# EAGLE design mini (EAGLE 6.2)
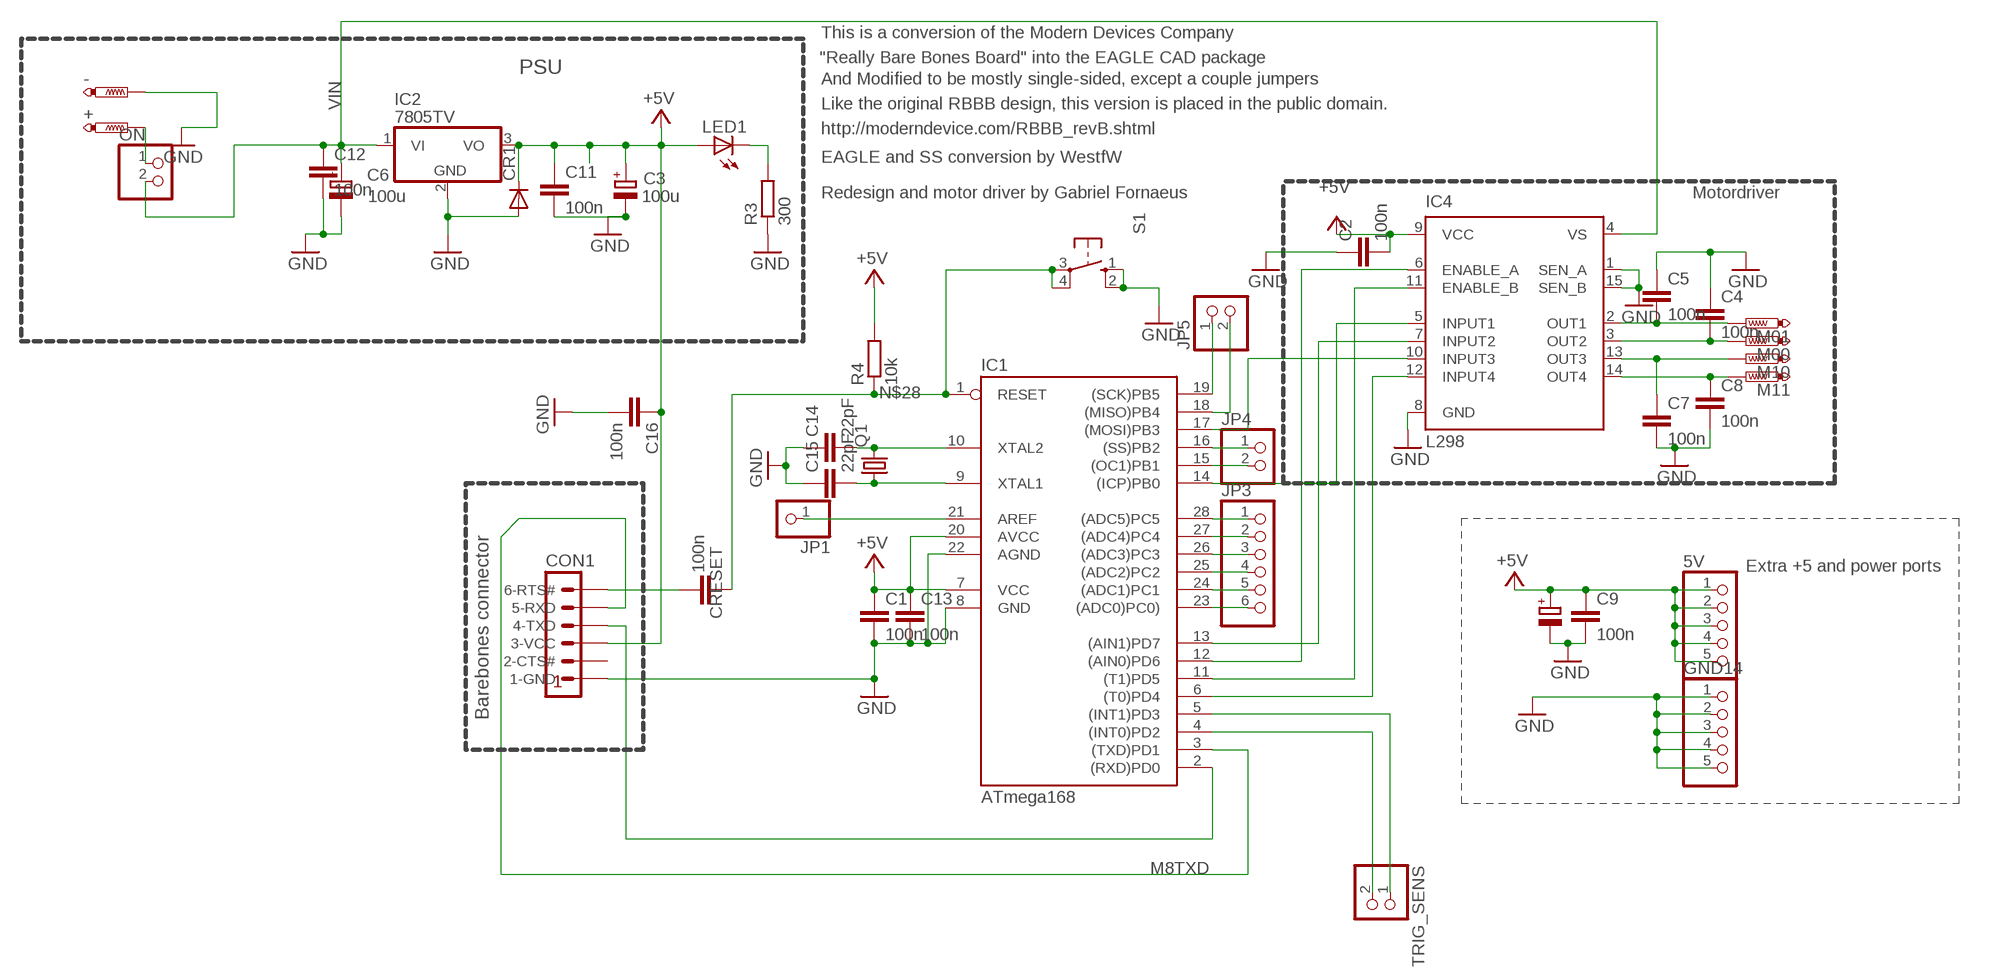
[diagram p0: schematic, sheet 1]

## Parts
5V  PINHD-1X5  [1X05]
+  PTR1PAD1-13Y  [P1-13Y]
-  PTR1PAD1-13Y  [P1-13Y]
C1  100n  C-EU025-025X050  [C025-025X050]
C2  100n  C-EU025-025X050  [C025-025X050]
C3  100u  CPOL-EUE2.5-7  [E2,5-7]
C4  100n  C-EU025-025X050  [C025-025X050]
C5  100n  C-EU025-025X050  [C025-025X050]
C6  100u  CPOL-EUE2.5-7  [E2,5-7]
C7  100n  C-EU025-025X050  [C025-025X050]
C8  100n  C-EU025-025X050  [C025-025X050]
C9  100n  C-EU025-025X050  [C025-025X050]
C10  100u  CPOL-EUE2.5-7  [E2,5-7]
C11  100n  C-EU025-025X050  [C025-025X050]
C12  100n  C-EU025-025X050  [C025-025X050]
C13  100n  C-EU025-025X050  [C025-025X050]
C14  22pF  C-EU025-024X044  [C025-024X044]
C15  22pF  C-EU025-024X044  [C025-024X044]
C16  100n  C-EU025-025X050  [C025-025X050]
CON1  FTDI-TTL232R  [MA06-1]
CR1  DIODE-1ARECT-2V  [DO41-2V]
CRESET  100n  C-EU025-025X050  [C025-025X050]
GND14  PINHD-1X5  [1X05]
IC1  ATmega168  AT90S4433P  [DIL28-3]
IC2  7805TV  [TO220V]
IC4  L298  [MULTIWATT-15]
JP1  PINHD-1X1  [1X01]
JP3  PINHD-1X6  [1X06]
JP4  PINHD-1X2  [1X02]
JP5  PINHD-1X2  [1X02]
LED1  LED3MM  [LED3MM]
M00  PTR1PAD1-13Y  [P1-13Y]
M01  PTR1PAD1-13Y  [P1-13Y]
M10  PTR1PAD1-13Y  [P1-13Y]
M11  PTR1PAD1-13Y  [P1-13Y]
ON  PINHD-1X2  [1X02]
Q1  CRYSTALHC49S  [HC49/S]
R3  300  R-EU_0204/7  [0204/7]
R4  10k  R-EU_0204/7  [0204/7]
S1  10-XX  [B3F-10XX]
TRIG_SENS  PINHD-1X2  [1X02]

## Nets
+5V [power]: 5V.1 5V.2 5V.3 5V.4 5V.5 C1.1 C2.2 C3.+ C9.1 C10.+ C11.1 C13.1 C16.1 CON1.3(3-VCC) CR1.C IC1.7(VCC) IC1.20(AVCC) IC2.3(VO) IC4.9(VCC) LED1.A R4.2
GND [power]: -.TP C1.2 C2.1 C3.- C4.1 C5.1 C6.- C7.2 C8.2 C9.2 C10.- C11.2 C12.2 C13.2 C14.1 C15.1 C16.2 CON1.1(1-GND) CR1.A GND14.1 GND14.2 GND14.3 GND14.4 GND14.5 IC1.8(GND) IC1.22(AGND) IC2.2(GND) IC4.1(SEN_A) IC4.8(GND) IC4.15(SEN_B) R3.1 S1.1(S) S1.2(S1)
M8RXD: CON1.4(4-TXD) IC1.2((RXD)PD0)
M8TXD: CON1.5(5-RXD) IC1.3((TXD)PD1)
N$1: IC1.28((ADC5)PC5) JP3.1
N$2: LED1.K(C) R3.2
N$3: IC1.13((AIN1)PD7) IC4.7(INPUT2)
N$4: IC1.27((ADC4)PC4) JP3.2
N$5: IC1.26((ADC3)PC3) JP3.3
N$6: C15.2 IC1.9(XTAL1) Q1.1
N$7: C14.2 IC1.10(XTAL2) Q1.2
N$8: CON1.6(6-RTS#) CRESET.1
N$9: IC1.11((T1)PD5) IC4.11(ENABLE_B)
N$10: IC1.6((T0)PD4) IC4.12(INPUT4)
N$11: C7.1 IC4.13(OUT3) M10.TP
N$12: IC1.25((ADC2)PC2) JP3.4
N$13: C8.1 IC4.14(OUT4) M11.TP
N$14: IC1.14((ICP)PB0) IC4.5(INPUT1)
N$15: C4.2 IC4.3(OUT2) M00.TP
N$16: IC1.24((ADC1)PC1) JP3.5
N$17: IC1.23((ADC0)PC0)) JP3.6
N$18: C5.2 IC4.2(OUT1) M01.TP
N$19: IC1.17((MOSI)PB3) IC4.10(INPUT3)
N$20: IC1.12((AIN0)PD6) IC4.6(ENABLE_A)
N$21: +.TP ON.1
N$22: IC1.16((SS)PB2) JP4.1
N$23: IC1.15((OC1)PB1) JP4.2
N$24: IC1.18((MISO)PB4) JP5.2
N$25: IC1.19((SCK)PB5) JP5.1
N$28: CRESET.2 IC1.1(RESET) R4.1 S1.3(P) S1.4(P1)
N$29: IC1.21(AREF) JP1.1
N$30: IC1.5((INT1)PD3) TRIG_SENS.1
N$31: IC1.4((INT0)PD2) TRIG_SENS.2
VIN [power]: C6.+ C12.1 IC2.1(VI) IC4.4(VS) ON.2
Unconnected: CON1.2(2-CTS#)

## Notes on the sheet
- This is a conversion of the Modern Devices Company
- "Really Bare Bones Board" into the EAGLE CAD package
- PSU
- And Modified to be mostly single-sided, except a couple jumpers
- Like the original RBBB design, this version is placed in the public domain.
- http://moderndevice.com/RBBB_revB.shtml
- EAGLE and SS conversion by WestfW
- Redesign and motor driver by Gabriel Fornaeus | Motordriver
- Extra +5 and power ports
- Barebones connector

## Library data of the parts
5V GND14 = pinhead:PINHD-1X5: PIN HEADER
+ - M00 M01 M10 M11 = testpad:PTR1: TEST PIN
C1 C2 C4 C5 C7-C9 C11-C13 C16 CRESET = my-rcl:C-EU: CAPACITOR, European symbol
C3 C6 C10 = my-rcl:CPOL-EU: POLARIZED CAPACITOR, European symbol
C14 C15 = resistor:C-EU: CAPACITOR, European symbol
CON1 = mylib4:FTDI-TTL232R: FTDI USB to serial (TTL level) cable
CR1 = mylib4:DIODE-1ARECT
IC1 = atmel:AT90S4433: MICROCONTROLLER 4 Kbytes FLASH 128 bytes SRAM 256 bytes EEPROM UART 6-channel 10 bit ADC
IC2 = linear:78*: Positive VOLTAGE REGULATOR Source: http://cache.national.com/ds/LM/LM78L05.pdf http://www.fairchildsemi.com/ds/LM/LM7805.pdf
IC4 = st-microelectronics:L298: DUAL FULL-BRIDGE DRIVER; MPN: L298N; OC_FARNELL: 1589425; OC_NEWARK: 32M1527
JP1 = pinhead:PINHD-1X1: PIN HEADER
JP3 = pinhead:PINHD-1X6: PIN HEADER
JP4 JP5 ON TRIG_SENS = pinhead:PINHD-1X2: PIN HEADER
LED1 = led:LED: LED OSRAM: - CHIPLED LG R971, LG N971, LY N971, LG Q971, LY Q971, LO R971, LY R971 LH N974, LH R974 LS Q976, LO Q976, LY Q976 LO Q996 - Hyper CHIPLED LW Q18S LB Q993, LB Q99A, LB R99A - SideLED LS A670, LO A670, LY A670, LG A670, LP A670 LB A673, LV A673, LT A673, LW A673 LH A674 LY A675 LS A676, LA A676, LO A676, LY A676, LW A676 LS A679, LY A679, LG A679 - Hyper Micro SIDELED® LS Y876, LA Y876, LO Y876, LY Y876 LT Y87S - SmartLED LW L88C, LW L88S LB L89C, LB L89S, LG L890 LS L89K, LO L89K, LY L89K LS L896, LA L896, LO L896, LY L896 - TOPLED LS T670, LO T670, LY T670, LG T670, LP T670 LSG T670, LSP T670, LSY T670, LOP T670, LYG T670 LG T671, LOG T671, LSG T671 LB T673, LV T673, LT T673, LW T673 LH T674 LS T676, LA T676, LO T676, LY T676, LB T676, LH T676, LSB T676, LW T676 LB T67C, LV T67C, LT T67C, LS T67K, LO T67K, LY T67K, LW E67C LS E67B, LA E67B, LO E67B, LY E67B, LB E67C, LV E67C, LT E67C LW T67C LS T679, LY T679, LG T679 LS T770, LO T770, LY T770, LG T770, LP T770 LB T773, LV T773, LT T773, LW T773 LH T774 LS E675, LA E675, LY E675, LS T675 LS T776, LA T776, LO T776, LY T776, LB T776 LHGB T686 LT T68C, LB T68C - Hyper Mini TOPLED® LB M676 - Mini TOPLED Santana® LG M470 LS M47K, LO M47K, LY M47K Source: http://www.osram.convergy.de - LUMILED® LXK2-PW12-R00, LXK2-PW12-S00, LXK2-PW14-U00, LXK2-PW14-V00 LXK2-PM12-R00, LXK2-PM12-S00, LXK2-PM14-U00 LXK2-PE12-Q00, LXK2-PE12-R00, LXK2-PE12-S00, LXK2-PE14-T00, LXK2-PE14-U00 LXK2-PB12-K00, LXK2-PB12-L00, LXK2-PB12-M00, LXK2-PB14-N00, LXK2-PB14-P00, LXK2-PB14-Q00 LXK2-PR12-L00, LXK2-PR12-M00, LXK2-PR14-Q00, LXK2-PR14-R00 LXK2-PD12-Q00, LXK2-PD12-R00, LXK2-PD12-S00 LXK2-PH12-R00, LXK2-PH12-S00 LXK2-PL12-P00, LXK2-PL12-Q00, LXK2-PL12-R00 Source: www.luxeon.com
Q1 = crystal:CRYSTAL: CRYSTAL; OC_FARNELL: 1667008; OC_NEWARK: unknown
R3 R4 = resistor:R-EU_: RESISTOR, European symbol
S1 = switch-omron:10-XX: OMRON SWITCH

## Net classes
0 default: width 0.4 mm, clearance 0.3 mm
1 power: width 0.6 mm, clearance 0.3 mm

## Board
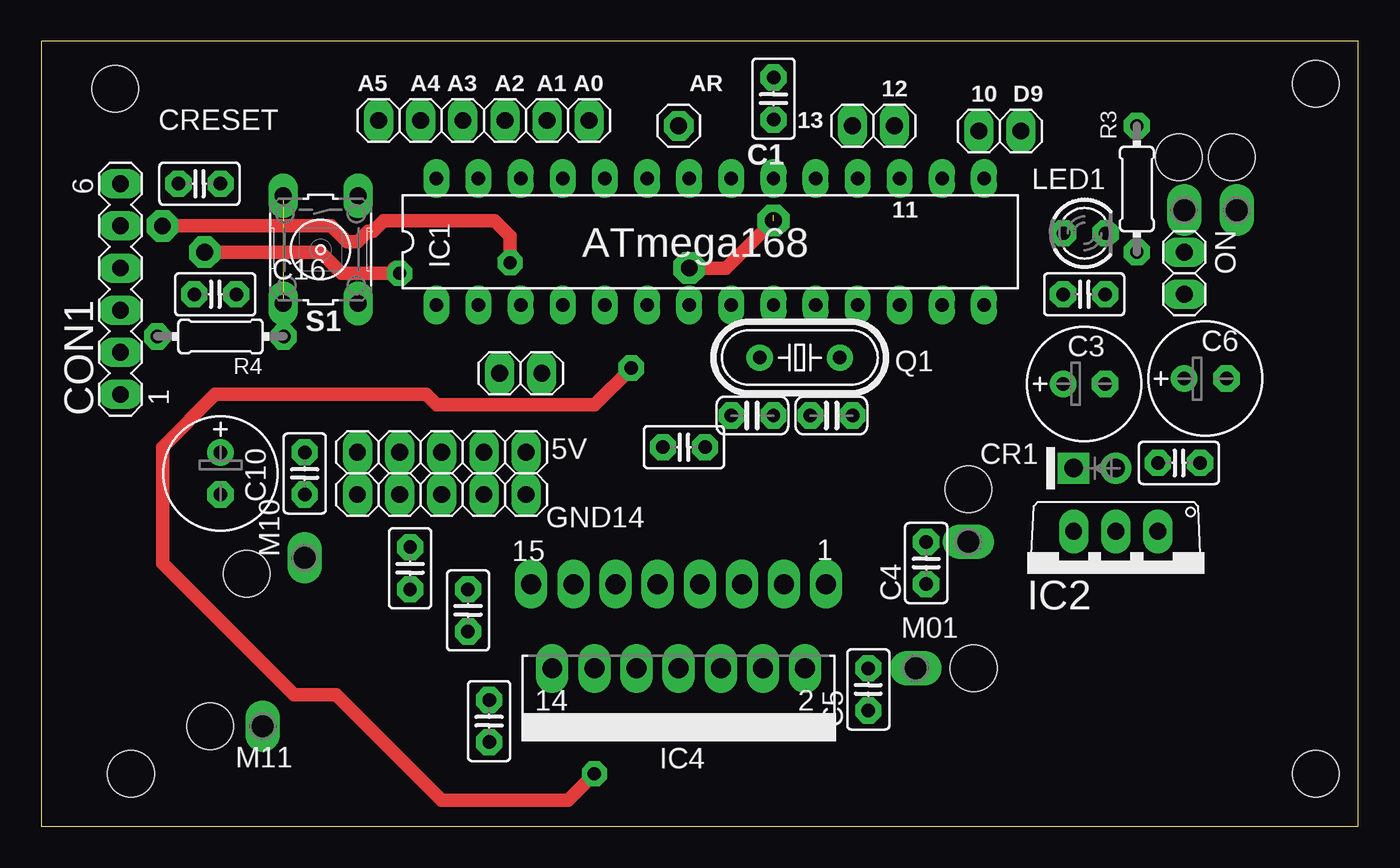
[diagram p1: board, top side]
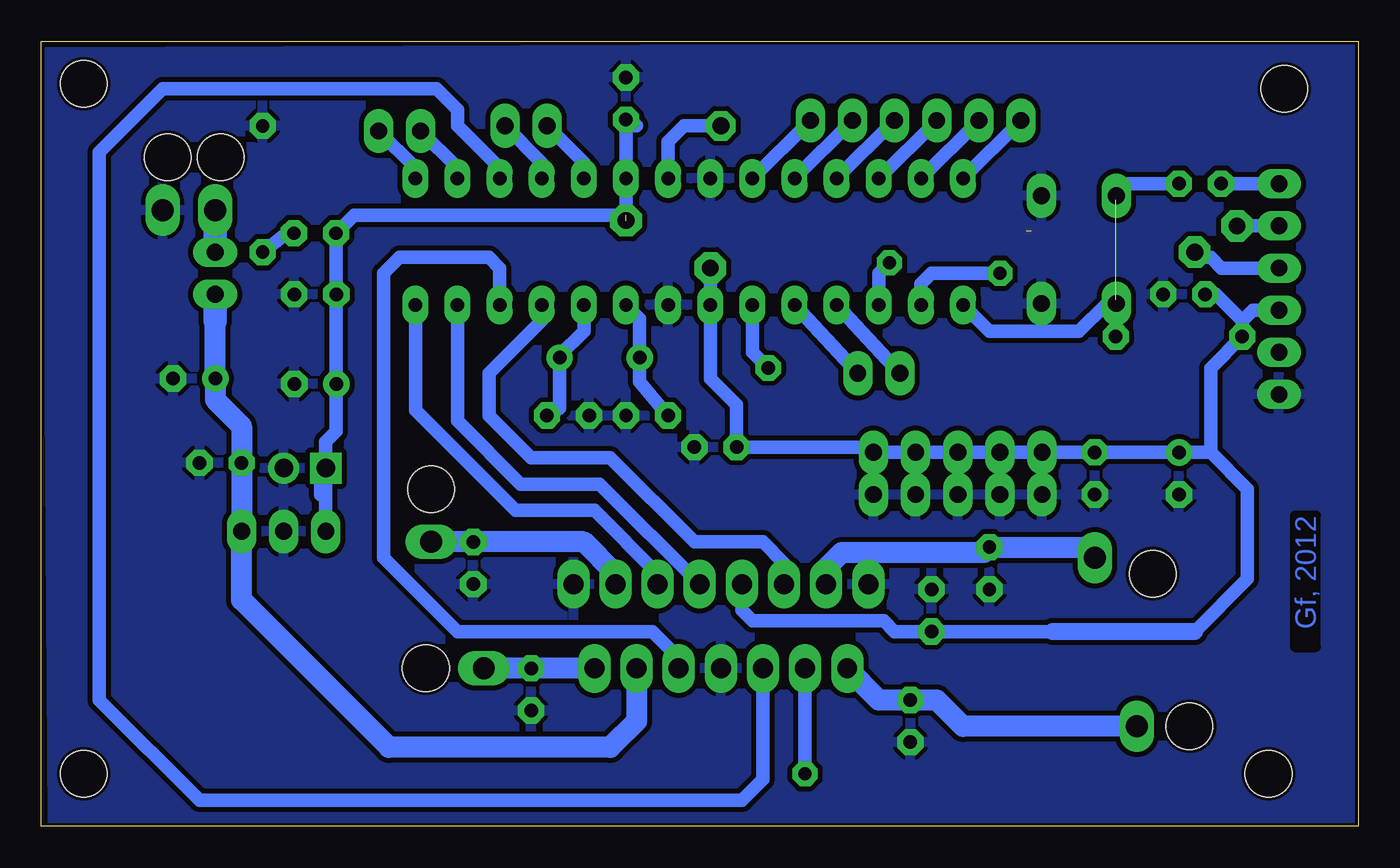
[diagram p2: board, bottom side, seen from below]

Size 79.38 x 47.31 mm. Coordinates in mm from the lower left corner, seen from the top.
Outline: 0,0 79.37,0 79.37,47.31 0,47.31 0,0
Copper layers (1*16): Top 0.035mm / dielectric 1.5mm / Bottom 0.035mm
Design rules: minimum track width 14mil, minimum drill 0.8mm, track to track 0.3mm, track to pad 0.3mm, pad to pad 0.3mm, via to via 8mil, smd to smd 8mil, copper to edge 8mil, drill to drill 8mil, minimum pad ring 15mil, minimum via ring 8mil, stop-mask expansion 8mil, vias tented up to drill 0mil, thermal gap 10mil
Holes 2.8 mm at 5.4,3.18 76.84,44.77 76.84,3.18 4.45,44.45 12.38,15.24 10.16,6.03 55.88,20.32 56.2,9.53 71.75,40.32 68.58,40.32

### Footprints (pad centres in the part's own frame; a part is rotated, then mirrored left to right if it is on the bottom)
1X05 = drill 1.016 long: 1 -5.08,0; 2 -2.54,0; 3 0,0; 4 2.54,0; 5 5.08,0
P1-13Y = drill 1.321 pad 1.905 long: TP 0,0
C025-025X050@1 = drill 0.813 octagon: 1 -1.27,0; 2 1.27,0
C025-025X050 = drill 0.813 octagon: 1 -1.27,0; 2 1.27,0
E2,5-7@1 = drill 0.813 pad 1.6: + -1.27,0 | drill 0.813 pad 1.6 octagon: - 1.27,0
E2,5-7 = drill 0.813 pad 1.6: + -1.27,0 | drill 0.813 pad 1.6 octagon: - 1.27,0
C025-024X044 = drill 0.813 octagon: 1 -1.27,0; 2 1.27,0
MA06-1 = drill 1.016 long: 1 -6.35,0; 2 -3.81,0; 3 -1.27,0; 4 1.27,0; 5 3.81,0; 6 6.35,0
DO41-2V = drill 1.118: A 1.27,0 | drill 1.118 square: C -1.27,0
DIL28-3 = drill 0.813 long: 1 -16.51,-3.81; 2 -13.97,-3.81; 3 -11.43,-3.81; 4 -8.89,-3.81; 5 -6.35,-3.81; 6 -3.81,-3.81; 7 -1.27,-3.81; 8 1.27,-3.81; 9 3.81,-3.81; 10 6.35,-3.81; 11 8.89,-3.81; 12 11.43,-3.81; 13 13.97,-3.81; 14 16.51,-3.81; 15 16.51,3.81; 16 13.97,3.81; 17 11.43,3.81; 18 8.89,3.81; 19 6.35,3.81; 20 3.81,3.81; 21 1.27,3.81; 22 -1.27,3.81; 23 -3.81,3.81; 24 -6.35,3.81; 25 -8.89,3.81; 26 -11.43,3.81; 27 -13.97,3.81; 28 -16.51,3.81
TO220V = drill 1.016 long: 1 -2.54,-2.54; 2 0,-2.54; 3 2.54,-2.54
MULTIWATT-15 = drill 1.2 long: 1 -8.89,-7.62; 2 -7.62,-2.54; 3 -6.35,-7.62; 4 -5.08,-2.54; 5 -3.81,-7.62; 6 -2.54,-2.54; 7 -1.27,-7.62; 8 0,-2.54; 9 1.27,-7.62; 10 2.54,-2.54; 11 3.81,-7.62; 12 5.08,-2.54; 13 6.35,-7.62; 14 7.62,-2.54; 15 8.89,-7.62
1X01 = drill 1.016 octagon: 1 0,0
1X06 = drill 1.016 long: 1 -6.35,0; 2 -3.81,0; 3 -1.27,0; 4 1.27,0; 5 3.81,0; 6 6.35,0
1X02 = drill 1.016 long: 1 -1.27,0; 2 1.27,0
LED3MM = drill 0.813 octagon: A -1.27,0; K 1.27,0
HC49/S = drill 0.813: 1 -2.413,0; 2 2.413,0
0204/7 = drill 0.813 octagon: 1 -3.81,0; 2 3.81,0
B3F-10XX = drill 1.016 long: 1 -3.251,2.261; 2 3.251,2.261; 3 -3.251,-2.261; 4 3.251,-2.261

### Placement (x,y rotation side)
5V  24.13,22.54 0 top
+  68.9,37.15 180 top
-  72.07,37.15 180 top
C1  100n  [C025-025X050@1]  44.14,43.87 90 top
C2  25.72,13.02 270 top
C3  100u  [E2,5-7@1]  62.87,26.67 0 top
C4  53.34,15.88 90 top
C5  49.85,8.26 90 top
C6  100u  [E2,5-7@1]  70.17,26.99 0 top
C7  22.23,15.56 270 top
C8  26.99,6.35 270 top
C9  15.88,21.27 270 top
C10  10.79,21.27 270 top
C11  62.87,32.07 0 top
C12  68.58,21.91 0 top
C13  38.73,22.86 0 top
C14  47.62,24.77 0 top
C15  42.86,24.77 180 top
C16  10.48,32.07 0 top
CON1  4.76,32.38 90 top
CR1  63.5,21.59 0 top
CRESET  100n  [C025-025X050@1]  9.53,38.73 0 top
GND14  24.13,20 0 top
IC1  40.32,35.24 0 top
IC2  64.77,15.24 180 top
IC4  38.42,6.99 180 top
JP1  38.42,42.23 0 top
JP3  26.67,42.55 0 top
JP4  57.79,41.91 0 top
JP5  50.16,42.23 0 top
LED1  62.88,35.75 0 top
M00  55.88,17.14 90 top
M01  52.7,9.53 90 top
M10  15.88,16.19 0 top
M11  13.33,6.03 0 top
ON  68.9,33.34 270 top
Q1  45.72,28.26 0 top
R3  66.04,38.42 270 top
R4  10.79,29.53 180 top
S1  16.83,34.77 270 top
TRIG_SENS  28.89,27.3 180 top

### Tracks (layer width: path | path; a pad name or v marks a point on that pad's centre or on a via)
+5V  (via drill 1)  (1 unrouted)
  Top 0.813: v39.05,33.65 41.27,33.65 44.13,36.51
  Bottom 0.813: 62.23,21.91 CR1.C | CR1.C IC2.3 | 62.23,21.91 62.23,23.18 61.59,23.81 C3.+ C11.1 61.61,32.09 LED1.A 60.53,36.83 44.13,36.83 IC1.20 44.13,42.23 | 62.23,21.91 62.55,21.59 62.55,21.27 | 62.55,20 62.55,21.27 | 62.55,21.27 CR1.C | 44.13,42.23 C1.1 | C13.1 37.47,23.18 | 9.84,11.75 6.67,14.92 6.67,20.32 8.89,22.54 | 44.13,42.23 43.5,42.23 | IC1.7 39.05,26.99 37.47,25.4 37.47,23.18 | 37.47,23.18 37.15,22.86 29.53,22.86 29.53,22.54 5V.4 | CON1.3 6.35,31.11 6.99,30.48 | 6.99,30.48 R4.2 8.89,27.62 8.89,22.54 | C16.1 8.57,32.07 6.99,30.48 | 8.89,22.54 C10.+ C9.1 5V.1 5V.2 5V.3 5V.4 | 39.05,31.75 IC1.7 | IC1.7 v39.05,33.65 | 17.78,11.75 18.41,11.75 C2.2 27.94,11.75 28.58,12.38 36.51,12.38 37.15,13.02 IC4.9 | 5V.4 5V.5
  Bottom 1.016: 9.84,11.75 18.41,11.75
GND
  pour Bottom: 0.32,46.99 79.06,46.67 78.74,0.32 0.32,0.32
M8RXD  (via drill 0.8, 1)
  Top 0.813: 21.27,33.65 v21.59,33.34 18.1,33.34 16.83,34.61 v9.84,34.61
  Bottom 0.813: IC1.2 26.35,32.7 25.72,33.34 v21.59,33.34 | CON1.4 8.25,33.65 8.89,34.29 9.53,34.29 v9.84,34.61
M8TXD  (via drill 0.8, 1)  (1 unrouted)
  Top 0.813: 20,35.88 20.64,36.51 27.31,36.51 28.26,35.56 v28.26,33.97 | v7.3,36.2 17.46,36.2 18.41,35.24 19.05,35.24 19.69,35.88
  Bottom 0.813: IC1.3 28.89,33.34 v28.26,33.97 | CON1.5 v7.3,36.2
N$1
  Bottom 0.813: JP3.1 IC1.28
N$2
  Bottom 0.813: LED1.K 64.58,35.75 R3.2
N$3
  Bottom 0.813: IC1.13 54.29,24.45 50.48,20.64 45.72,20.64 IC4.7
N$4
  Bottom 0.813: JP3.2 IC1.27
N$5
  Bottom 0.813: JP3.3 IC1.26
N$6
  Bottom 0.813: IC1.9 43.31,30.61 Q1.1 43.31,26.8 C15.2
N$7
  Bottom 0.813: IC1.10 46.67,29.84 48.13,28.38 Q1.2 48.13,25.21 C14.2
N$8
  Bottom 0.813: CON1.6 CRESET.1
N$9
  Bottom 0.813: IC4.11 34.61,15.88 35.88,17.15 40.01,17.15 45.08,22.22 49.85,22.22 52.39,24.77 52.39,27.31 49.21,30.48 IC1.11
N$10  (via drill 0.8)
  Top 0.813: v33.34,3.18 31.75,1.59 24.13,1.59 17.78,7.94 15.24,7.94 7.3,15.88 7.3,22.86 10.48,26.04 23.18,26.04 23.81,25.4 33.34,25.4 v35.56,27.62
  Bottom 0.813: IC4.12 v33.34,3.18 | IC1.6 36.51,28.57 v35.56,27.62
N$11
  Bottom 1.27: IC4.13 32.07,15.56 31.12,16.51 22.54,16.51 C7.1 16.51,16.83 M10.TP
N$12
  Bottom 0.813: JP3.4 IC1.25
N$13
  Bottom 1.27: M11.TP 23.81,6.03 25.4,7.62 C8.1 28.89,7.62 IC4.14
N$14
  Bottom 0.813: 56.83,31.11 IC1.14 56.83,25.08 50.8,19.05 46.04,19.05 42.23,15.24 IC4.5
N$15
  Bottom 0.813: C4.2 56.2,17.15
  Bottom 1.27: IC4.3 44.77,15.24 46.67,17.15 C4.2 M00.TP
N$16
  Bottom 0.813: JP3.5 IC1.24
N$17
  Bottom 0.813: JP3.6 IC1.23
N$18
  Bottom 1.27: IC4.2 C5.2 M01.TP
N$19
  Bottom 0.813: IC4.10 35.88,2.86 37.15,1.59 69.85,1.59 75.88,7.62 75.88,40.64 72.07,44.45 55.56,44.45 54.29,43.18 54.29,42.23 52.07,40 52.07,39.37 IC1.17
N$20
  Bottom 0.813: IC4.6 40.96,10.16 42.55,11.75 54.29,11.75 58.74,16.19 58.74,33.34 57.79,34.29 52.39,34.29 51.75,33.65 IC1.12
N$21
  Bottom 1.422: +.TP ON.1
N$22
  Bottom 0.813: IC1.16 54.29,39.69 JP4.1
N$23
  Bottom 0.813: IC1.15 56.83,39.69 JP4.2
N$24
  Bottom 0.813: IC1.18 49.21,40 JP5.2
N$25
  Bottom 0.813: IC1.19 46.67,40 JP5.1
N$27  (via drill 1)
  other vias: 44.13,36.51
N$28  (1 unrouted)
  Bottom 0.4: 14.61,37.78 S1.3 | 14.61,31.75 S1.4
  Bottom 0.813: CRESET.2 13.85,38.73 S1.3 14.57,38.06 14.61,38.1 | R4.1 14.61,31.48 S1.4 15.16,31.52 16.83,29.84 22.22,29.84 IC1.1 23.73,31.52
N$29
  Bottom 0.813: 41.59,38.73 IC1.21 41.59,41.28 40.64,42.23 JP1.1
N$30
  Bottom 0.813: TRIG_SENS.1 IC1.5
N$31
  Bottom 0.813: TRIG_SENS.2 IC1.4
N$32  (via drill 1)
  other vias: 39.05,33.66
VIN
  Bottom 1.27: IC4.4 43.5,6.35 45.08,4.76 58.42,4.76 67.31,13.65 IC2.1 C12.1 67.31,24.13 68.9,25.72 C6.+ 68.9,30.48
  Bottom 1.422: ON.2 68.9,30.48

### Text on the board
Bottom: Gf, 2012
tNames: A5 | A4 | A3 | A2 | A1 | A0 | AR | 12 | 10 | D9 | 13 | 11
Reference: D2 | D3
Edit History: connection provided by switch internals | Wire | 20120815: Gabriel Fornaeus | Based on the RBBB